# Altium schematic sheet Core.SchDoc
size A4 portrait
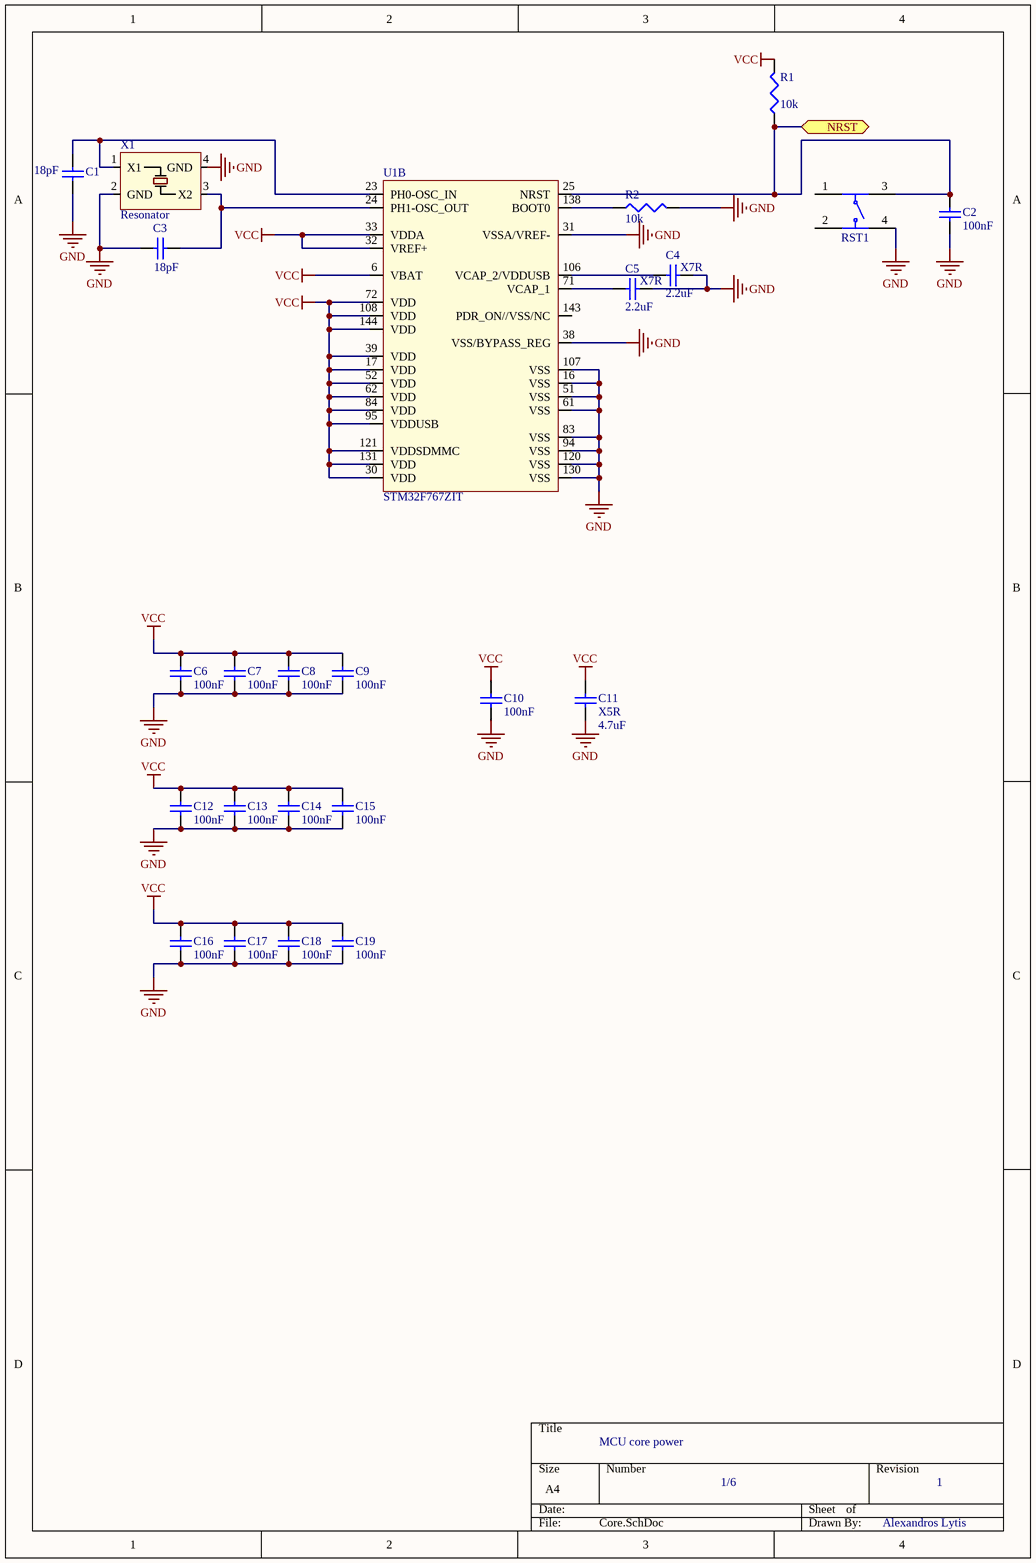
[diagram p0: Core.SchDoc]

## Parts
C1  value 18pF  [CAP0603]  (hidden comment: Cap Semi)
C2  value 100nF  [CAP0603]  (hidden comment: Cap Semi)
C3  value 18pF  [CAP0603]  (hidden comment: Cap Semi)
C4  X7R  value 2.2uF  [CAP0603]
C5  X7R  value 2.2uF  [CAP0603]
C6  value 100nF  [CAP0603]  (hidden comment: Cap Semi)
C7  value 100nF  [CAP0603]  (hidden comment: Cap Semi)
C8  value 100nF  [CAP0603]  (hidden comment: Cap Semi)
C9  value 100nF  [CAP0603]  (hidden comment: Cap Semi)
C10  value 100nF  [CAP0603]  (hidden comment: Cap Semi)
C11  X5R  value 4.7uF  [CAP0603]
C12  value 100nF  [CAP0603]  (hidden comment: Cap Semi)
C13  value 100nF  [CAP0603]  (hidden comment: Cap Semi)
C14  value 100nF  [CAP0603]  (hidden comment: Cap Semi)
C15  value 100nF  [CAP0603]  (hidden comment: Cap Semi)
C16  value 100nF  [CAP0603]  (hidden comment: Cap Semi)
C17  value 100nF  [CAP0603]  (hidden comment: Cap Semi)
C18  value 100nF  [CAP0603]  (hidden comment: Cap Semi)
C19  value 100nF  [CAP0603]  (hidden comment: Cap Semi)
R1  value 10k  [RES0603]  (hidden comment: Res3)
R2  value 10k  [RES0603]  (hidden comment: Res3)
RST1  430152043826  [4301x20438x6]  (value not drawn)
U1  STM32F767ZIT  [TSQFP50P2200X2200X160-144N]  (part B of 4)
X1  Resonator  [ABM8G]

## Ports
NRST

## Nets
GND: C1.1 C2.1 C3.1 C4.2 C5.2 C6.1 C7.1 C8.1 C9.1 C10.1 C11.1 C12.1 C13.1 C14.1 C15.1 C16.1 C17.1 C18.1 C19.1 R2.2 RST1.4 U1.16(VSS) U1.31(VSSA/VREF-) U1.38(VSS/BYPASS_REG) U1.51(VSS) U1.61(VSS) U1.83(VSS) U1.94(VSS) U1.107(VSS) U1.120(VSS) U1.130(VSS) X1.2(GND) X1.4(GND)
VCC: C6.2 C7.2 C8.2 C9.2 C10.2 C11.2 C12.2 C13.2 C14.2 C15.2 C16.2 C17.2 C18.2 C19.2 R1.2 U1.6(VBAT) U1.17(VDD) U1.30(VDD) U1.32(VREF+) U1.33(VDDA) U1.39(VDD) U1.52(VDD) U1.62(VDD) U1.72(VDD) U1.84(VDD) U1.95(VDDUSB) U1.108(VDD) U1.121(VDDSDMMC) U1.131(VDD) U1.144(VDD)
NRST: C2.2 R1.1 RST1.3 U1.25(NRST) ; port NRST
NetC1_2: C1.2 U1.23(PH0-OSC_IN) X1.1(X1)
NetC3_2: C3.2 U1.24(PH1-OSC_OUT) X1.3(X2)
NetC4_1: C4.1 U1.106(VCAP_2/VDDUSB)
NetC5_1: C5.1 U1.71(VCAP_1)
NetR2_1: R2.1 U1.138(BOOT0)

Not connected (* = marked no-connect by the designer): RST1 1 2; U1 143(PDR_ON//VSS/NC)

## Notes on the sheet
- MCU core power
- 1/6
- 1
- Alexandros Lytis

## Library data of the parts
C1-C19 = Cap Semi: Capacitor (Semiconductor SIM Model); Published: 8-Jun-2000; LatestRevisionDate: 29-May-2009; LatestRevisionNote: IPC-7351 Footprint Added.; PackageReference: C1206; Publisher: Altium Limited; PackageDescription: Chip Capacitor
R1 R2 = Res3: Resistor; Published: 8-Jun-2000; LatestRevisionDate: 29-May-2009; LatestRevisionNote: IPC-7351 Footprint Added.; PackageReference: J1-0603; Publisher: Altium Limited; PackageDescription: Chip Resistor
RST1 = WS-TASV, 430152043826: WS-TASV 6x6 mm SMD; Manufacturer: Wurth Elektronik; partNo: 430152043826; ComponentLink1Description: Manufacturer; ComponentLink1URL: http://www.we-online.de; Created by: Baojun Chen; Created Date: Dec.2015; ComponentLink2Description: Datasheet; ComponentLink2URL: http://katalog.we-online.de/em/datasheet/4301x2xxx8x6.pdf
X1 = ABM8G-MHz